# Altium project ESC_PIC32MK.PrjPcb
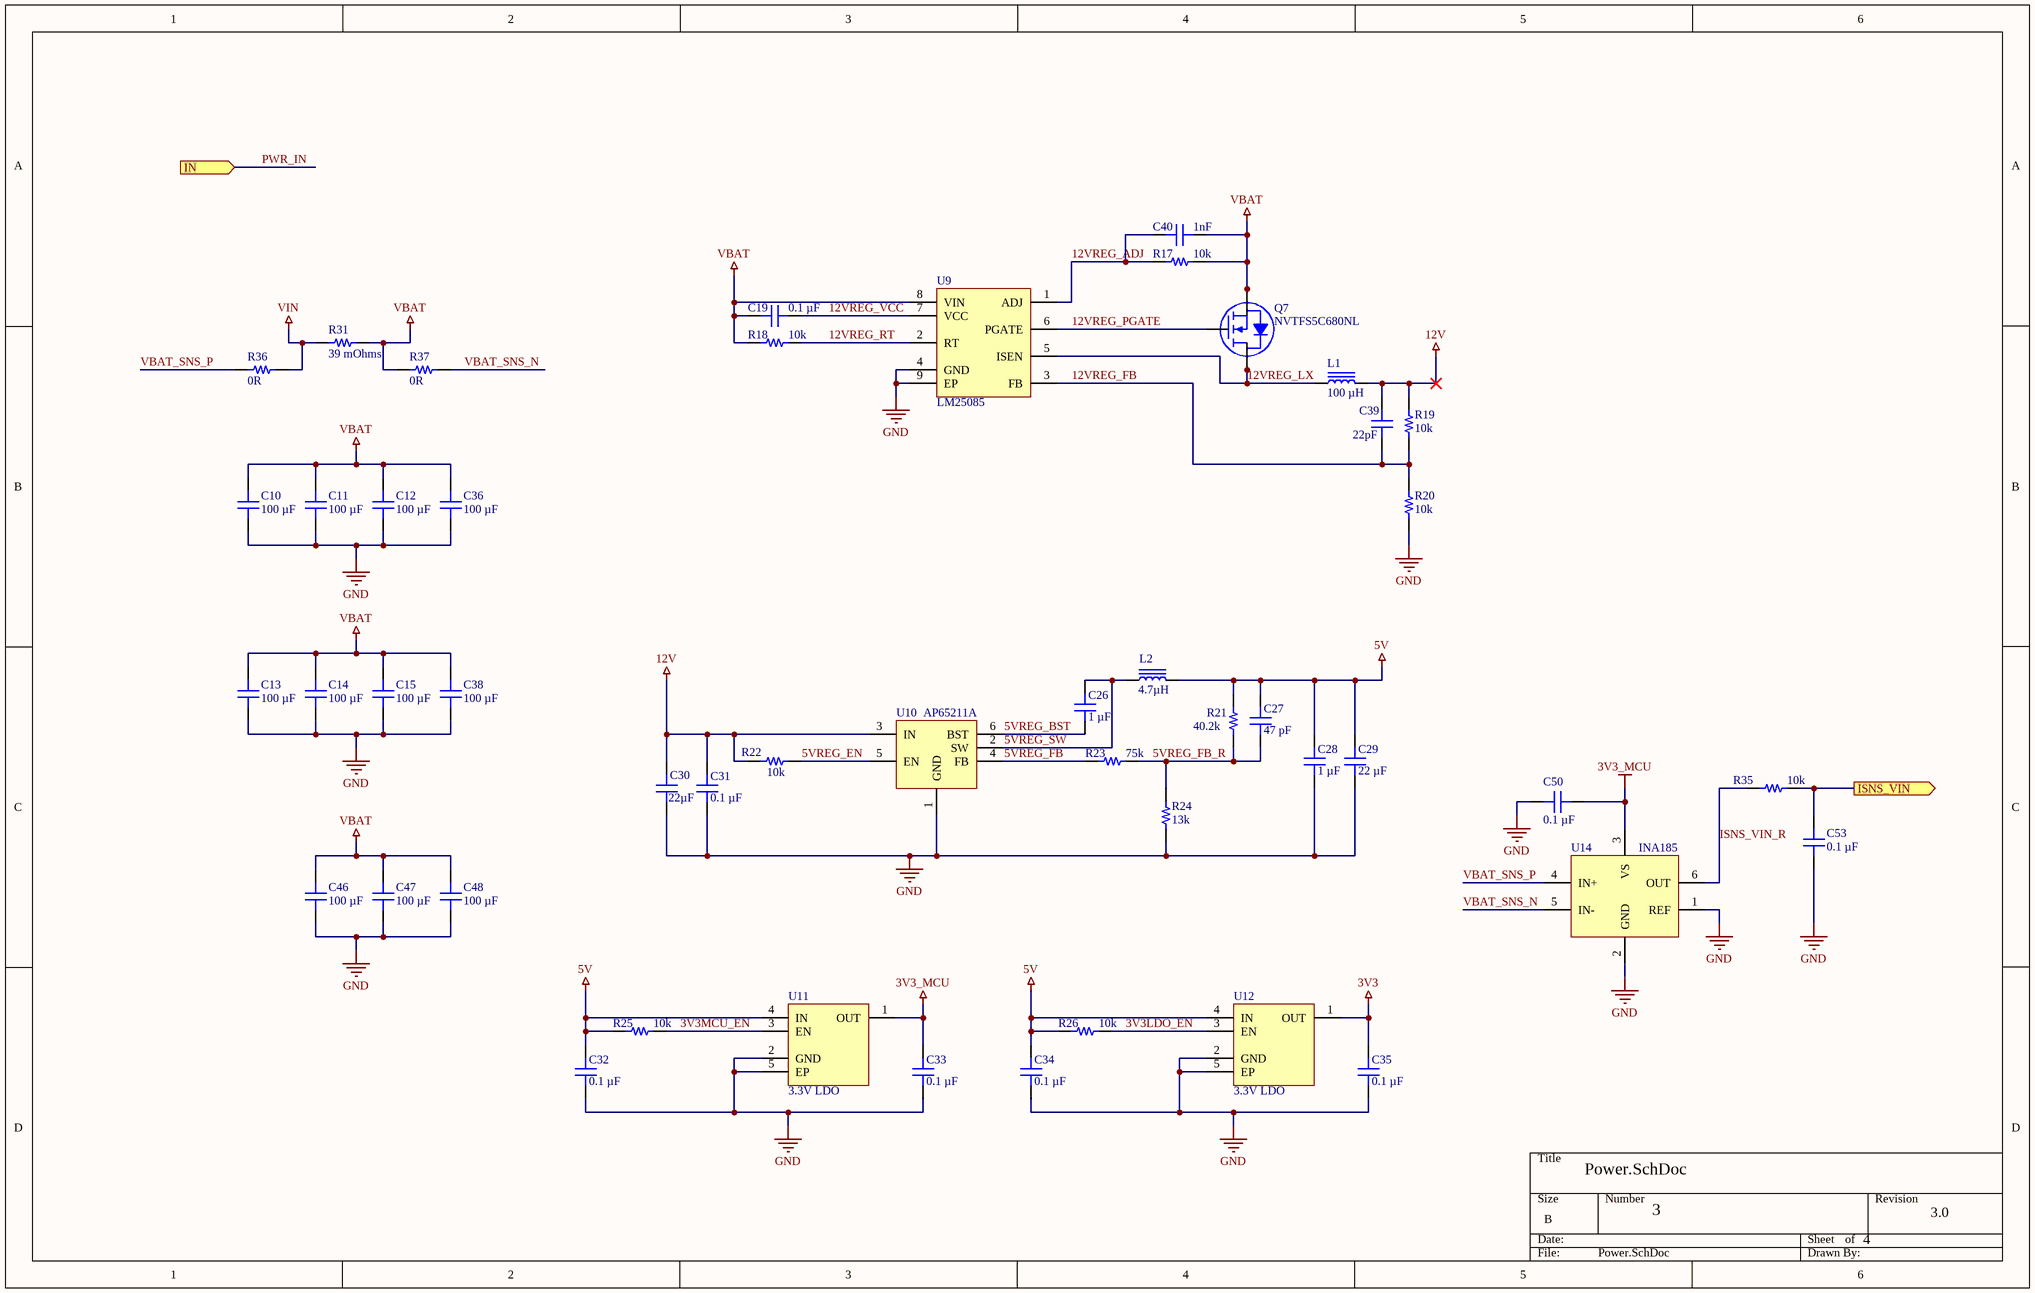
[diagram p0: Power.SchDoc]
Project: Cubli; ProjectRevision: 3.0
1 sheet, 48 parts. Net scope: hierarchical (ports join the sheet entries above them; power ports are global).
Board file: ESC_PIC32MK.PcbDoc

## Sheet Power.SchDoc
size B; DocumentNumber: 4; SheetNumber: 3; SheetTotal: 4

### Parts
C10  100 µF  [CAP 1210_3225 - 1MM]
C11  100 µF  [CAP 1210_3225 - 1MM]
C12  100 µF  [CAP 1210_3225 - 1MM]
C13  100 µF  [CAP 1210_3225 - 1MM]
C14  100 µF  [CAP 1210_3225 - 1MM]
C15  100 µF  [CAP 1210_3225 - 1MM]
C19  0.1 µF  [CAP 0402_1005]
C26  1 µF  [CAP 0402_1005]
C27  47 pF  [CAP 0402_1005]
C28  1 µF  [CAP 0402_1005]
C29  22 µF  [CAP 0402_1005]
C30  22µF  [CAP 0805_2012]
C31  0.1 µF  [CAP 0402_1005]
C32  0.1 µF  [CAP 0402_1005]
C33  0.1 µF  [CAP 0402_1005]
C34  0.1 µF  [CAP 0402_1005]
C35  0.1 µF  [CAP 0402_1005]
C36  100 µF  [CAP 1210_3225 - 1MM]
C38  100 µF  [CAP 1210_3225 - 1MM]
C39  22pF  [CAP 0402_1005]
C40  1nF  [CAP 0402_1005]
C46  100 µF  [CAP 1210_3225 - 1MM]
C47  100 µF  [CAP 1210_3225 - 1MM]
C48  100 µF  [CAP 1210_3225 - 1MM]
C50  0.1 µF  [CAP 0402_1005]
C53  0.1 µF  [CAP 0402_1005]
L1  100 µH  [TDK VLCF4028-2]
L2  4.7µH  [IND 1008_2520]
Q7  NVTFS5C680NL  [NVTFS015N04CTAG]
R17  10k  [RES 0402_1005]
R18  10k  [RES 0402_1005]
R19  10k  [RES 0402_1005]
R20  10k  [RES 0402_1005]
R21  40.2k  [RES 0402_1005]
R22  10k  [RES 0402_1005]
R23  75k  [RES 0402_1005]
R24  13k  [RES 0402_1005]
R25  10k  [RES 0402_1005]
R26  10k  [RES 0402_1005]
R31  39 mOhms  [RES 1206_3216]
R35  10k  [RES 0402_1005]
R36  0R  [RES 0201_0603]
R37  0R  [RES 0201_0603]
U9  LM25085  [8_WSON_3x3_0.5mm]
U10  AP65211A  [TSOT-26-6]
U11  3.3V LDO  [XDFN-4]
U12  3.3V LDO  [XDFN-4]
U14  INA185  [TI SC70-6 DCK]

### Ports
IN (in), ISNS_VIN (out)

### Nets
3V3: C35.2 U12.1(OUT)
3V3_MCU: C33.2 C50.1 U11.1(OUT) U14.3(VS)
5V: C27.2 C28.2 C29.2 C32.2 C34.2 L2.2 R21.2 R25.1 R26.1 U11.4(IN) U12.4(IN)
12V: C30.2 C31.2 C39.2 L1.2 R19.2 R22.1 U10.3(IN)
GND: C10.1 C11.1 C12.1 C13.1 C14.1 C15.1 C28.1 C29.1 C30.1 C31.1 C32.1 C33.1 C34.1 C35.1 C36.1 C38.1 C46.1 C47.1 C48.1 C50.2 C53.2 R20.1 R24.1 U9.4(GND) U9.9(EP) U10.1(GND) U11.2(GND) U11.5(EP) U12.2(GND) U12.5(EP) U14.1(REF) U14.2(GND)
VBAT: C10.2 C11.2 C12.2 C13.2 C14.2 C15.2 C19.1 C36.2 C38.2 C40.2 C46.2 C47.2 C48.2 Q7.1(S) Q7.2(S) Q7.3(S) R17.2 R18.1 R31.2 R37.1 U9.8(VIN)
VIN: R31.1 R36.2
3V3LDO_EN: R26.2 U12.3(EN)
3V3MCU_EN: R25.2 U11.3(EN)
5VREG_BST: C26.1 U10.6(BST)
5VREG_EN: R22.2 U10.5(EN)
5VREG_FB: R23.1 U10.4(FB)
5VREG_FB_R: C27.1 R21.1 R23.2 R24.2
5VREG_SW: C26.2 L2.1 U10.2(SW)
12VREG_ADJ: C40.1 R17.1 U9.1(ADJ)
12VREG_FB: C39.1 R19.1 R20.2 U9.3(FB)
12VREG_LX: L1.1 Q7.5(D) Q7.6(D) Q7.7(D) Q7.8(D) U9.5(ISEN)
12VREG_PGATE: Q7.4(G) U9.6(PGATE)
12VREG_RT: R18.2 U9.2(RT)
12VREG_VCC: C19.2 U9.7(VCC)
ISNS_VIN: C53.1 R35.2 ; port ISNS_VIN
ISNS_VIN_R: R35.1 U14.6(OUT)
PWR_IN: port IN
VBAT_SNS_N: R37.2 U14.5(IN-)
VBAT_SNS_P: R36.1 U14.4(IN+)

### Library data of the parts
C10-C15 C36 C38 C46-C48 = MSASE32MAB5107MPNA01: CAP CER 100UF 16V X5R 1210; manufacturer: Taiyo Yuden; Tolerance: ±20%; Part Number: MSASE32MAB5107MPNA01; Value: 100 µF; Applications: SMPS Filtering; Capacitance: 100 µF; componentlink1description: Datasheet; componentlink1url: https://mm.digikey.com/Volume0/opasdata/d220001/medias/docus/5731/MSR01_e.pdf; componentlink2description: DigiKey Link; componentlink2url: https://www.digikey.com/en/products/detail/taiyo-yuden/MSASE32MAB5107MPNA01/16664685; Device Package: 1210 (3225 Metric); lastupdated: 6/4/2024 7:20:42 PM; Lifecycle Status: Active; Minimum Order: 1; Mounting Type: Surface Mount, MLCC; Operating Temperature: -55°C ~ 85°C; Package / Case: 1210 (3225 Metric); packaging: TapeAndReel; partid: 58478; price: 0.66; series: MSAS; Size / Dimension: 0.126" L x 0.098" W (3.20mm x 2.50mm); Supplier 1: DigiKey; Supplier Part Number 1: 587-MSASE32MAB5107MPNA01CT-ND; Temperature Coefficient: X5R; Thickness (Max): 0.110" (2.80mm); Voltage - Rated: 16V
C19 C31-C35 C50 C53 = C0402C104K4RACAUTO: CAP CER 0.1UF 16V X7R 0402; manufacturer: KEMET; Tolerance: ±10%; Part Number: C0402C104K4RACAUTO; Value: 0.1 µF; Applications: Automotive, Bypass, Decoupling; Capacitance: 0.1 µF; componentlink1description: Datasheet; componentlink1url: https://api.kemet.com/component-edge/download/specsheet/C0402C104K4RACAUTO.pdf; componentlink2description: DigiKey Link; componentlink2url: https://www.digikey.com/en/products/detail/kemet/C0402C104K4RACAUTO/3314827; Device Package: 0402 (1005 Metric); lastupdated: 8/14/2022 9:05:51 PM; Lifecycle Status: Active; Minimum Order: 1; Mounting Type: Surface Mount, MLCC; Operating Temperature: -55°C ~ 125°C; Package / Case: 0402 (1005 Metric); packaging: TapeAndReel; partid: 3024; Part Status: Active; price: 0.01; Ratings: AEC-Q200; series: SMD Auto X7R; Size / Dimension: 0.039" L x 0.020" W (1.00mm x 0.50mm); Supplier 1: DigiKey; Supplier Part Number 1: 399-6828-1-ND; Temperature Coefficient: X7R; Thickness (Max): 0.022" (0.55mm); Voltage - Rated: 16V
C26-C29 C39 C40 = C0402C104K4RACAUTO: CAP CER 0.1UF 16V X7R 0402; manufacturer: KEMET; Capacitance: 0.1 µF; Tolerance: ±10%; Part Number: C0402C104K4RACAUTO; Applications: Automotive, Bypass, Decoupling; componentlink1description: Datasheet; componentlink1url: https://api.kemet.com/component-edge/download/specsheet/C0402C104K4RACAUTO.pdf; componentlink2description: DigiKey Link; componentlink2url: https://www.digikey.com/en/products/detail/kemet/C0402C104K4RACAUTO/3314827; Device Package: 0402 (1005 Metric); lastupdated: 8/14/2022 9:05:51 PM; Lifecycle Status: Active; Minimum Order: 1; Mounting Type: Surface Mount, MLCC; Operating Temperature: -55°C ~ 125°C; Package / Case: 0402 (1005 Metric); packaging: TapeAndReel; partid: 3024; Part Status: Active; price: 0.01; Ratings: AEC-Q200; series: SMD Auto X7R; Size / Dimension: 0.039" L x 0.020" W (1.00mm x 0.50mm); Supplier 1: DigiKey; Supplier Part Number 1: 399-6828-1-ND; Temperature Coefficient: X7R; Thickness (Max): 0.022" (0.55mm); Voltage - Rated: 16V
  C26 C28: Value: 1 µF
  C27: Value: 47 pF
  C29: Value: 22 µF
  C39: Value: 22pF
  C40: Value: 1nF
C30 = C2012X7S1E106K125AC: CAP CER 10UF 25V X7S 0805; Manufacturer: TDK Corporation; Capacitance: 10µF; Tolerance: ±10%; Part Number: C2012X7S1E106K125AC; Value: 22µF; Applications: General Purpose; ComponentLink1Description: Datasheet; ComponentLink1URL: https://product.tdk.com/en/search/capacitor/ceramic/mlcc/info?part_no=C2012X7S1E106K125AC?ref_disty=digikey; ComponentLink2Description: DigiKey Link; ComponentLink2URL: http://digikey.com/product-detail/en/tdk-corporation/C2012X7S1E106K125AC/445-181600-1-ND/9991478; Device Package: 0805 (2012 Metric); Features: Low ESL; LastUpdated: 21-Jan-20 12:03:04 AM; Lifecycle Status: Active; Minimum Order: 1; Mounting Type: Surface Mount, MLCC; Operating Temperature: -55°C ~ 125°C; Package / Case: 0805 (2012 Metric); Packaging: TapeAndReel; PartId: 3339; Part Status: Active; Price: 0.15; Series: C; Size / Dimension: 0.079" L x 0.049" W (2.00mm x 1.25mm); Supplier 1: DigiKey; Supplier Part Number 1: 445-181600-1-ND; Temperature Coefficient: X7S; Thickness (Max): 0.057" (1.45mm); Voltage - Rated: 25V
L1 = VLCF4028T-101MR33-2: FIXED IND 100UH 330MA 1 OHM SMD; Manufacturer: TDK Corporation; DC Resistance (DCR): 1Ohm Max; Inductance Frequency - Test: 100 kHz; Material - Core: Ferrite; Shielding: Shielded; Tolerance: ±20%; Type: Drum Core, Wirewound; Part Number: VLCF4028T-101MR33-2; ComponentLink1Description: Datasheet; ComponentLink1URL: https://product.tdk.com/info/en/catalog/datasheets/inductor_commercial_power_vlcf4028-2_en.pdf?ref_disty=digikey; ComponentLink2Description: DigiKey Link; ComponentLink2URL: https://www.digikey.com/en/products/detail/tdk-corporation/VLCF4028T-101MR33-2/2465299; Current Rating (Amps): 330 mA; Current - Saturation: 330mA; Device Package: Nonstandard; Height - Seated (Max): 0.110" (2.80mm); Inductance: 100 µH; LastUpdated: 6/3/2024 8:02:44 PM; Lifecycle Status: Active; Minimum Order: 1; Mounting Type: Surface Mount; Operating Temperature: -40°C ~ 105°C; Package / Case: Nonstandard; Packaging: TapeAndReel; PartId: 200; Part Status: Active; Price: 0.30; Series: VLCF; Size / Dimension: 0.157" L x 0.157" W (4.00mm x 4.00mm); Supplier 1: DigiKey; Supplier Part Number 1: 445-6542-1-ND; Value: 100 µH
L2 = MLP2520S4R7ST0S1: FIXED IND 4.7UH 1A 110 MOHM SMD; Manufacturer: TDK Corporation; DC Resistance (DCR): 143mOhm Max; Inductance Frequency - Test: 2MHz; Material - Core: Ferrite; Shielding: Shielded; Tolerance: ±20%; Type: Multilayer; Part Number: MLP2520S4R7ST0S1; ComponentLink1Description: Datasheet; ComponentLink1URL: https://product.tdk.com/info/en/catalog/datasheets/inductor_commercial_power_mlp2520_en.pdf?ref_disty=digikey; ComponentLink2Description: DigiKey Link; ComponentLink2URL: http://digikey.com/product-detail/en/tdk-corporation/MLP2520S4R7ST0S1/445-6378-1-ND/2465705; Current Rating (Amps): 1A; Device Package: 1008 (2520 Metric); Height - Seated (Max): 0.039" (1.00mm); Inductance: 4.7µH; LastUpdated: 13-Aug-20 11:03:40 AM; Lifecycle Status: Active; Minimum Order: 1; Mounting Type: Surface Mount; Operating Temperature: -40°C ~ 125°C; Package / Case: 1008 (2520 Metric); Packaging: TapeAndReel; PartId: 3467; Part Status: Active; Price: 0.14; Series: MLP; Size / Dimension: 0.098" L x 0.079" W (2.50mm x 2.00mm); Supplier 1: DigiKey; Supplier Part Number 1: 445-6378-1-ND; Supplier Device Package: 1008 (2520 Metric); Value: 4.7µH
Q7 = NVTFS5C680NL: N-FET
R17-R26 R35 = RK73H1ETTP1432F: RES 14.3K OHM 1% 1/10W 0402; Manufacturer: KOA Speer Electronics, Inc.; Power (Watts): 0.1W, 1/10W; Resistance: 14.3 kOhms; Temperature Coefficient: ±100ppm/°C; Part Number: RK73H1ETTP1432F; ComponentLink1Description: Datasheet; ComponentLink1URL: http://www.koaspeer.com/catimages/Products/RK73H/RK73H.pdf; ComponentLink2Description: DigiKey Link; ComponentLink2URL: https://www.digikey.com/en/products/detail/koa-speer-electronics-inc/RK73H1ETTP1432F/9844351; Composition: Thick Film; Device Package: 0402 (1005 Metric); Features: Automotive AEC-Q200, Moisture Resistant; Height - Seated (Max): 0.016" (0.40mm); LastUpdated: 8/14/2022 9:23:49 PM; Lifecycle Status: Active; Minimum Order: 1; Number of Terminations: 2; Operating Temperature: -55°C ~ 155°C; Package / Case: 0402 (1005 Metric); Packaging: CutTape; PartId: 10193; Part Status: Active; Price: 0.01; Ratings: AEC-Q200; Series: RK73H; Size / Dimension: 0.039" L x 0.020" W (1.00mm x 0.50mm); Supplier 1: DigiKey; Supplier Part Number 1: 2019-RK73H1ETTP1432FCT-ND; Supplier Device Package: 0402; Tolerance: ±1%
  R17-R20 R22 R25 R26 R35: Value: 10k
  R21: Value: 40.2k
  R23: Value: 75k
  R24: Value: 13k
R31 = KRL1632E-M-R039-F-T5: RES 0.039 OHM 1% 3/4W 1206; Manufacturer: Susumu; Power (Watts): 0.75W, 3/4W; Temperature Coefficient: ±50ppm/°C; Part Number: KRL1632E-M-R039-F-T5; ComponentLink1Description: Datasheet; ComponentLink1URL: http://www.susumu.co.jp/common/pdf/n_catalog_partition09_en.pdf; ComponentLink2Description: DigiKey Link; ComponentLink2URL: https://www.digikey.com/en/products/detail/susumu/KRL1632E-M-R039-F-T5/3738003; Composition: Metal Foil; Device Package: 1206 (3216 Metric); Features: Automotive AEC-Q200, Current Sense; Height - Seated (Max): 0.028" (0.70mm); LastUpdated: 2/9/2024 8:54:46 PM; Lifecycle Status: Active; Minimum Order: 1; Number of Terminations: 2; Operating Temperature: -55°C ~ 155°C; Package / Case: 1206 (3216 Metric); Packaging: TapeAndReel; PartId: 26838; Part Status: Active; Price: 0.09; Ratings: AEC-Q200; Resistance: 39 mOhms; Series: KRL; Size / Dimension: 0.126" L x 0.063" W (3.20mm x 1.60mm); Supplier 1: DigiKey; Supplier Part Number 1: 408-1577-1-ND; Supplier Device Package: 1206; Tolerance: ±1%; Value: 39 mOhms
R36 R37 = CRG0201F10R: RES SMD 10 OHM 1% 1/20W 0201; Manufacturer: TE Connectivity Passive Product; Power (Watts): 0.05W, 1/20W; Resistance: 10 Ohms; Temperature Coefficient: ±400ppm/°C; Part Number: CRG0201F10R; Value: 0R; ComponentLink1Description: Datasheet; ComponentLink1URL: https://www.te.com/commerce/DocumentDelivery/DDEController?Action=srchrtrv&DocNm=1773204&DocType=DS&DocLang=English; ComponentLink2Description: DigiKey Link; ComponentLink2URL: https://www.digikey.com/en/products/detail/te-connectivity-passive-product/CRG0201F10R/4489648; Composition: Thick Film; Device Package: 0201 (0603 Metric); Height - Seated (Max): 0.010" (0.26mm); LastUpdated: 6/4/2024 7:12:02 PM; Lifecycle Status: Active; Minimum Order: 1; Number of Terminations: 2; Operating Temperature: -55°C ~ 155°C; Package / Case: 0201 (0603 Metric); Packaging: TapeAndReel; PartId: 3; Part Status: Active; Price: 0.02; Series: CRG, Neohm; Size / Dimension: 0.024" L x 0.012" W (0.60mm x 0.30mm); Supplier 1: DigiKey; Supplier Part Number 1: A129573CT-ND; Supplier Device Package: 0201; Tolerance: ±1%
U9 = LM25085: PFET Buck Controller
U10 = AP65211A: ADJ step down Buck
U11 U12 = TLV74033PDQNR
U14 = INA185: INA185A2

## Assembly variants
Main: not fitted R1